# Altium project PCB_Project1.PrjPcb
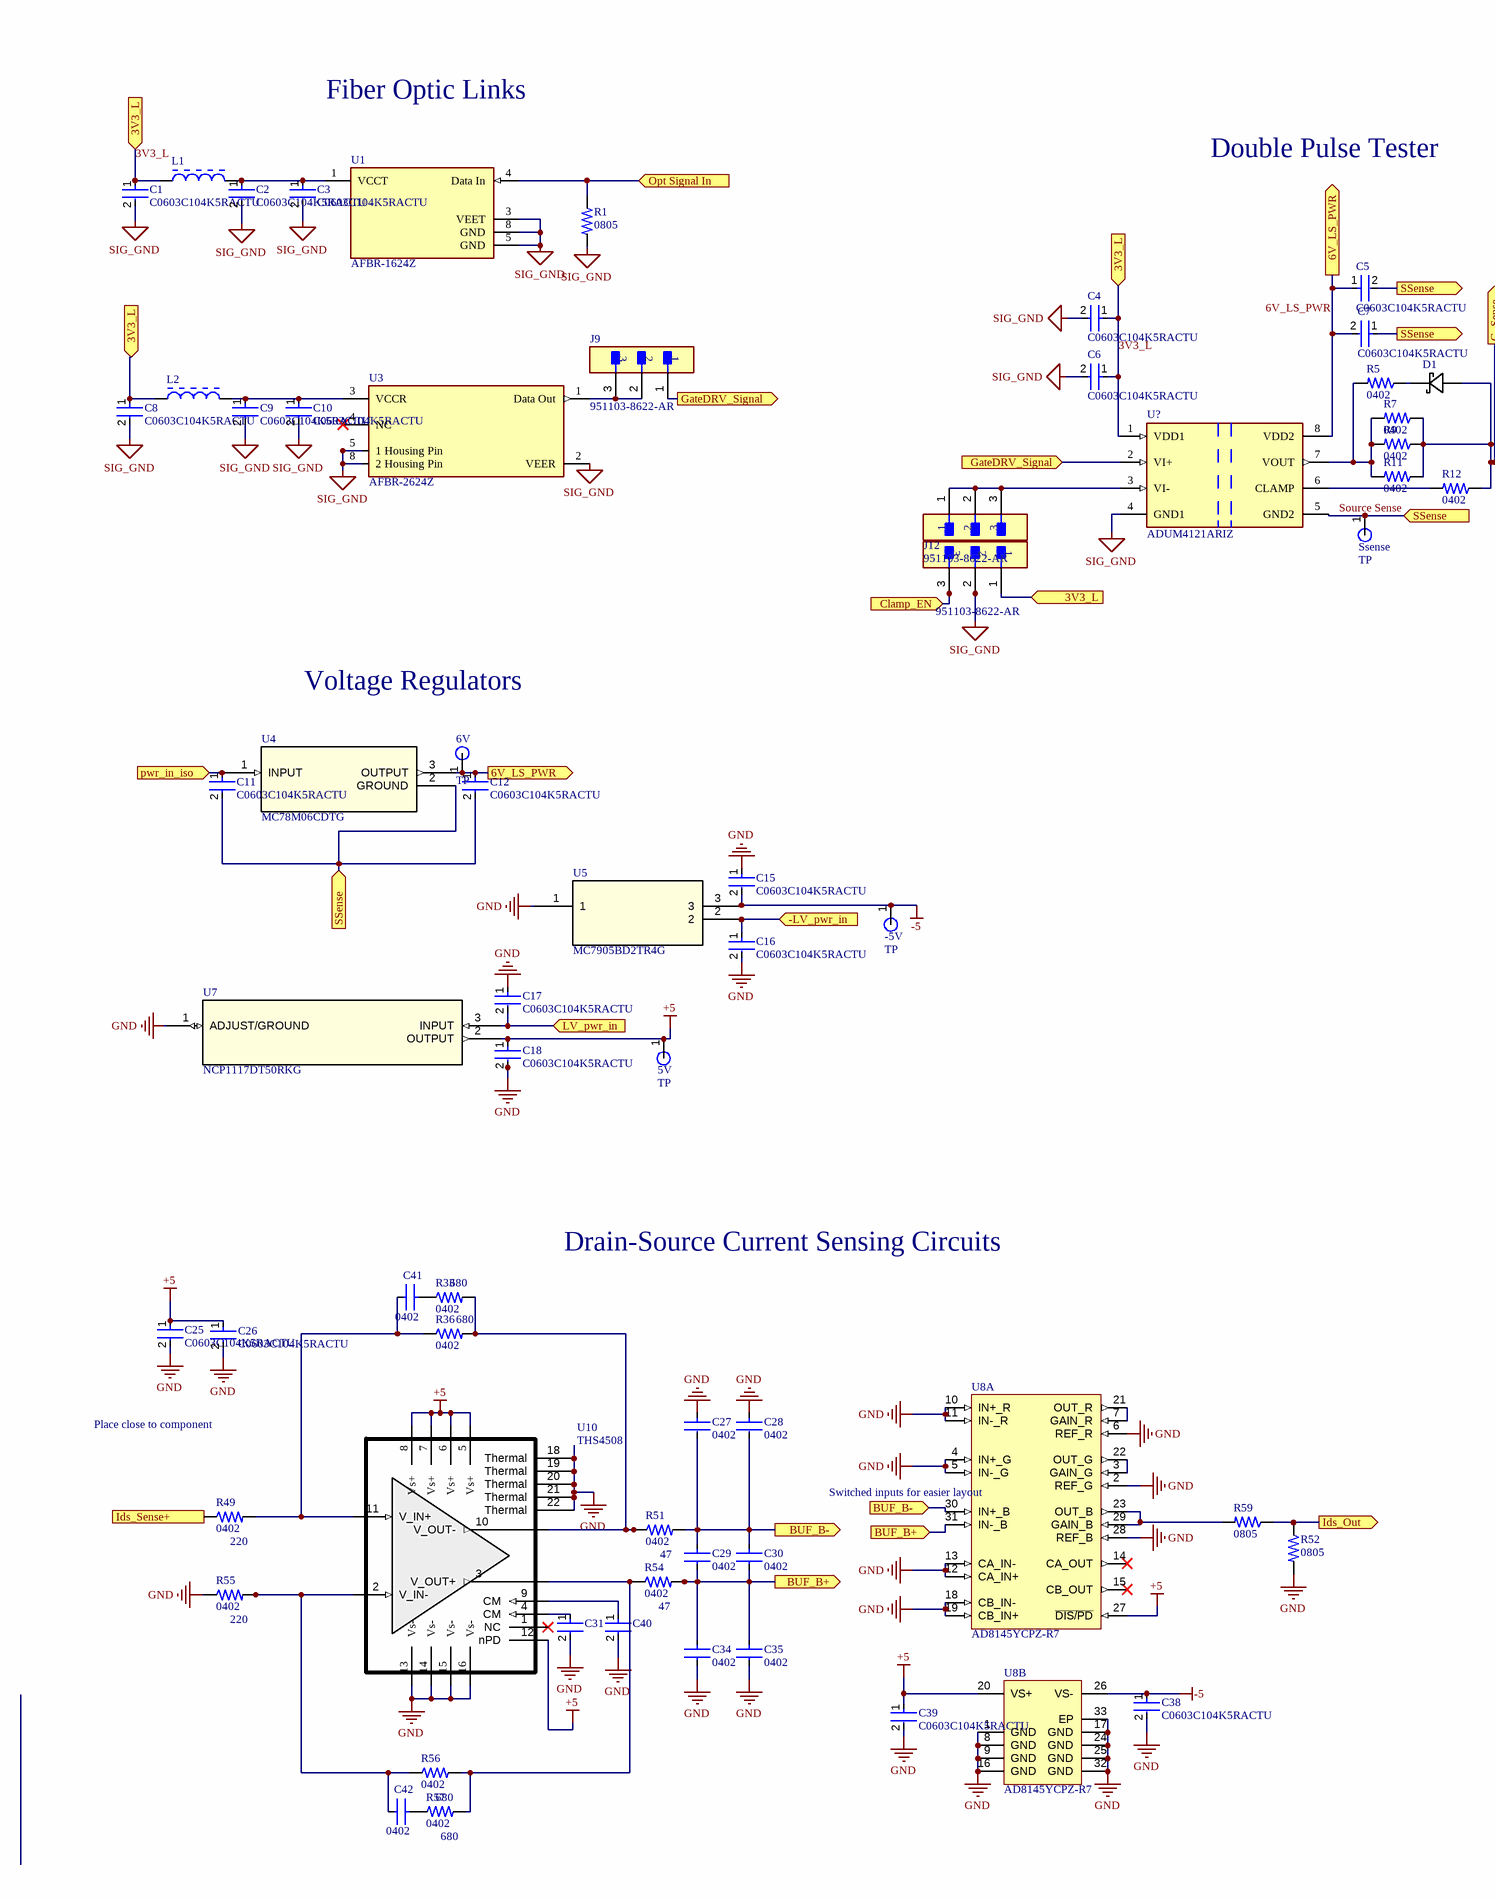
[diagram p0: DoublePulseTestCircuit.SchDoc, left]
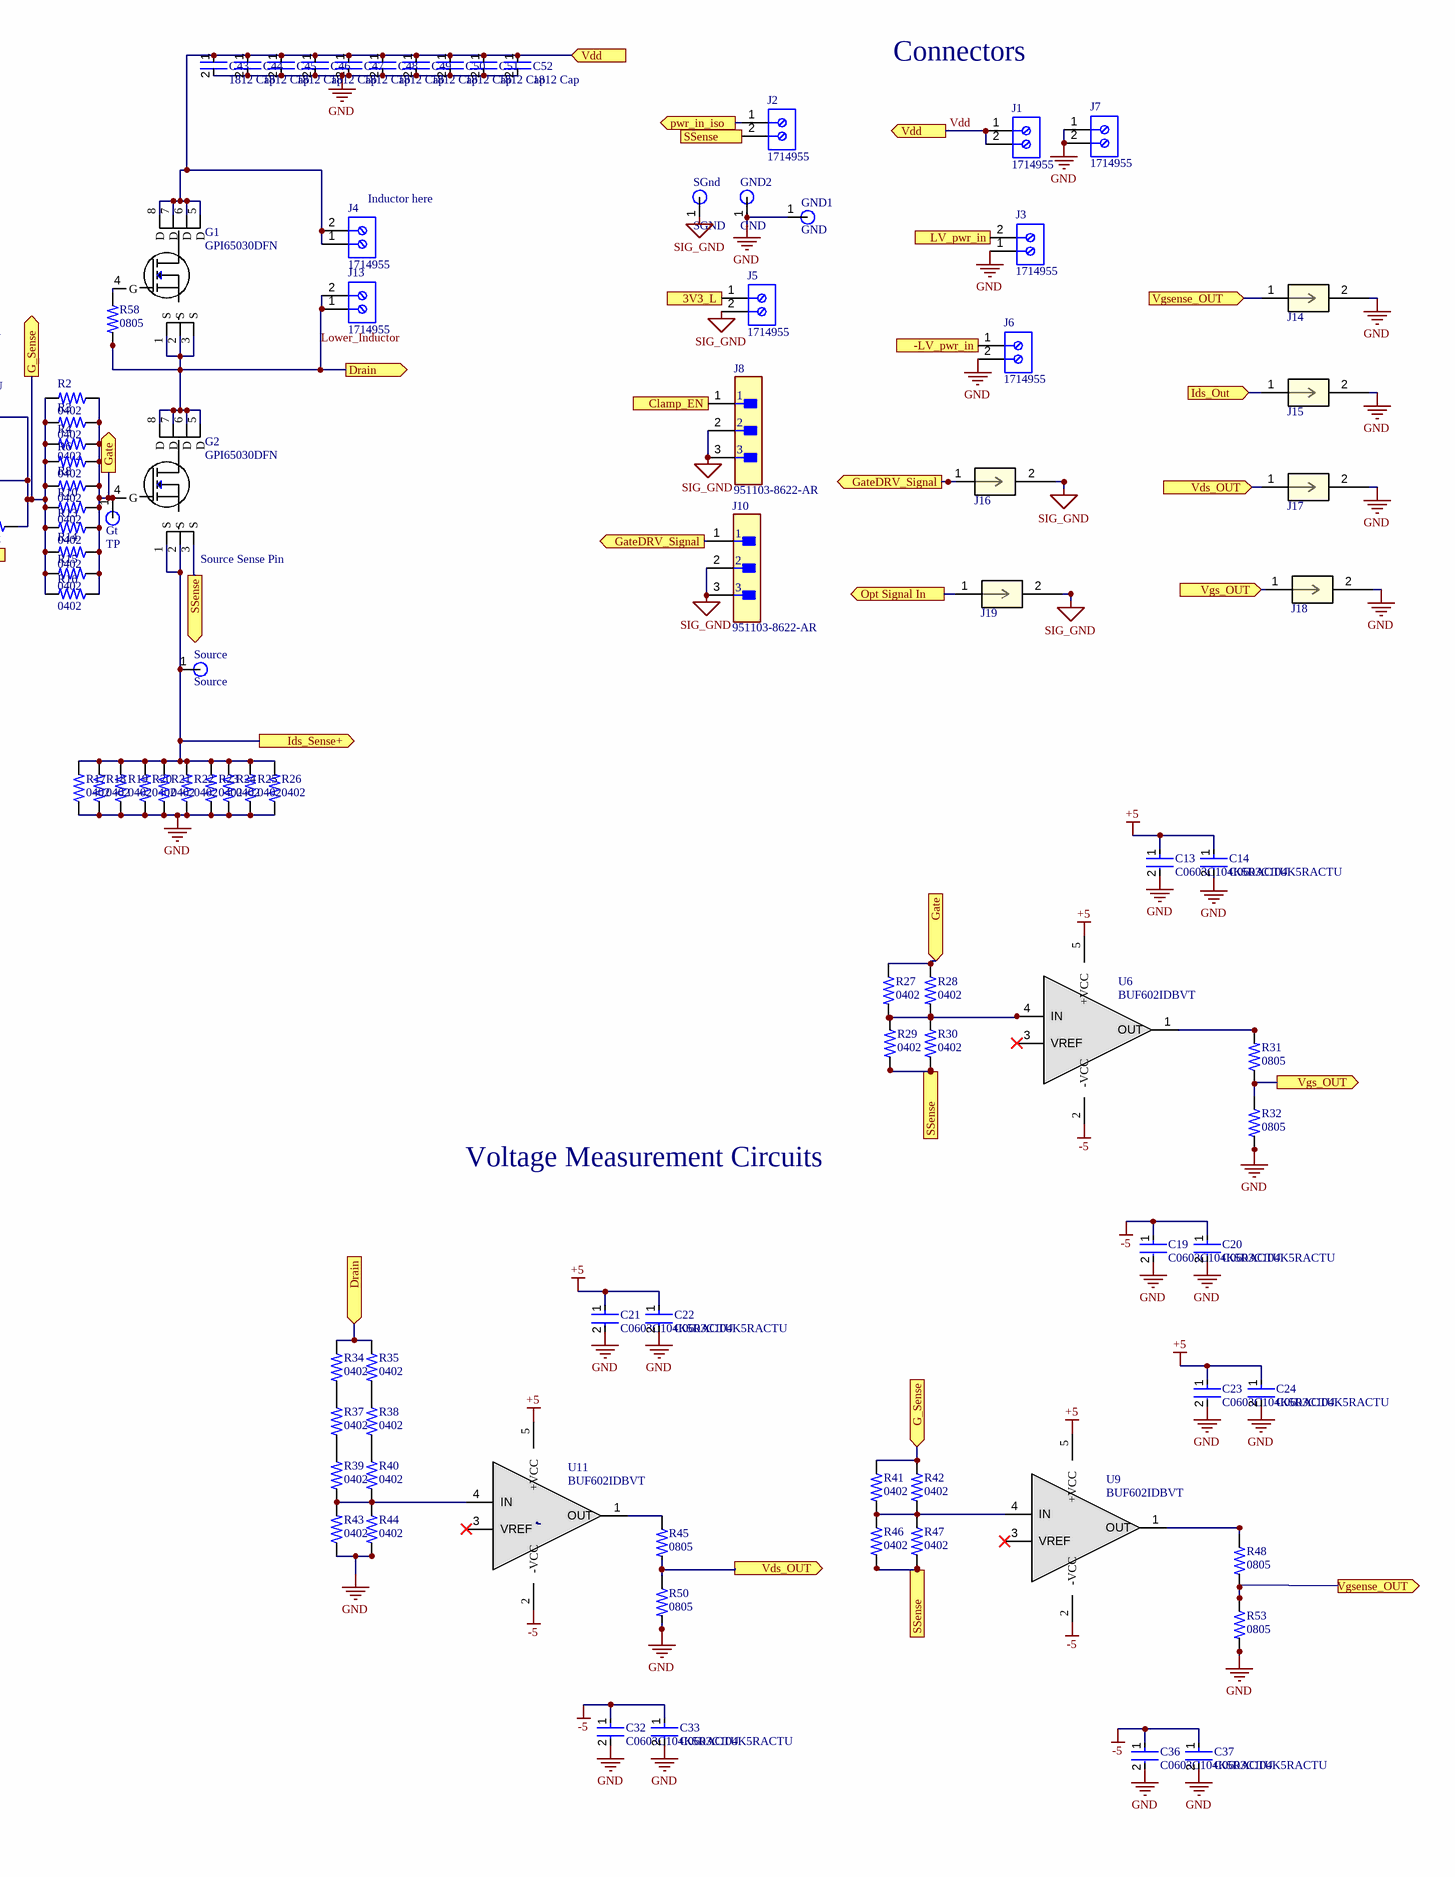
[diagram p1: DoublePulseTestCircuit.SchDoc, right]
1 sheet, 155 parts. Net scope: flat (ports and power ports of the same name join across sheets).
Board file: PCB1.PcbDoc

## Sheet DoublePulseTestCircuit.SchDoc
size 594 x 420 mm; SheetNumber: 1; SheetTotal: 1

### Parts
5V  TP  [Testpoint]
6V  TP  [Testpoint]
-5V  TP  [Testpoint]
C1  C0603C104K5RACTU  [FP-C0603C-CF-IPC_B]
C2  C0603C104K5RACTU  [FP-C0603C-CF-IPC_B]
C3  C0603C104K5RACTU  [FP-C0603C-CF-IPC_B]
C4  C0603C104K5RACTU  [FP-C0603C-CF-IPC_B]
C5  C0603C104K5RACTU  [FP-C0603C-CF-IPC_B]
C6  C0603C104K5RACTU  [FP-C0603C-CF-IPC_B]
C7  C0603C104K5RACTU  [FP-C0603C-CF-IPC_B]
C8  C0603C104K5RACTU  [FP-C0603C-CF-IPC_B]
C9  C0603C104K5RACTU  [FP-C0603C-CF-IPC_B]
C10  C0603C104K5RACTU  [FP-C0603C-CF-IPC_B]
C11  C0603C104K5RACTU  [FP-C0603C-CF-IPC_B]
C12  C0603C104K5RACTU  [FP-C0603C-CF-IPC_B]
C13  C0603C104K5RACTU  [FP-C0603C-CF-IPC_B]
C14  C0603C104K5RACTU  [FP-C0603C-CF-IPC_B]
C15  C0603C104K5RACTU  [FP-C0603C-CF-IPC_B]
C16  C0603C104K5RACTU  [FP-C0603C-CF-IPC_B]
C17  C0603C104K5RACTU  [FP-C0603C-CF-IPC_B]
C18  C0603C104K5RACTU  [FP-C0603C-CF-IPC_B]
C19  C0603C104K5RACTU  [FP-C0603C-CF-IPC_B]
C20  C0603C104K5RACTU  [FP-C0603C-CF-IPC_B]
C21  C0603C104K5RACTU  [FP-C0603C-CF-IPC_B]
C22  C0603C104K5RACTU  [FP-C0603C-CF-IPC_B]
C23  C0603C104K5RACTU  [FP-C0603C-CF-IPC_B]
C24  C0603C104K5RACTU  [FP-C0603C-CF-IPC_B]
C25  C0603C104K5RACTU  [FP-C0603C-CF-IPC_B]
C26  C0603C104K5RACTU  [FP-C0603C-CF-IPC_B]
C27  0402  [FP-C0402-BB-IPC_B]
C28  0402  [FP-C0402-BB-IPC_B]
C29  0402  [FP-C0402-BB-IPC_B]
C30  0402  [FP-C0402-BB-IPC_B]
C31  C0603C104K5RACTU  [FP-C0603C-CF-IPC_B]  (value not drawn)
C32  C0603C104K5RACTU  [FP-C0603C-CF-IPC_B]
C33  C0603C104K5RACTU  [FP-C0603C-CF-IPC_B]
C34  0402  [FP-C0402-BB-IPC_B]
C35  0402  [FP-C0402-BB-IPC_B]
C36  C0603C104K5RACTU  [FP-C0603C-CF-IPC_B]
C37  C0603C104K5RACTU  [FP-C0603C-CF-IPC_B]
C38  C0603C104K5RACTU  [FP-C0603C-CF-IPC_B]
C39  C0603C104K5RACTU  [FP-C0603C-CF-IPC_B]
C40  C0603C104K5RACTU  [FP-C0603C-CF-IPC_B]  (value not drawn)
C41  0402  [FP-C0402-BB-IPC_B]
C42  0402  [FP-C0402-BB-IPC_B]
C43  1812 Cap  [FP-C1812C104KDRACTU-IPC_A]
C44  1812 Cap  [FP-C1812C104KDRACTU-IPC_A]
C45  1812 Cap  [FP-C1812C104KDRACTU-IPC_A]
C46  1812 Cap  [FP-C1812C104KDRACTU-IPC_A]
C47  1812 Cap  [FP-C1812C104KDRACTU-IPC_A]
C48  1812 Cap  [FP-C1812C104KDRACTU-IPC_A]
C49  1812 Cap  [FP-C1812C104KDRACTU-IPC_A]
C50  1812 Cap  [FP-C1812C104KDRACTU-IPC_A]
C51  1812 Cap  [FP-C1812C104KDRACTU-IPC_A]
C52  1812 Cap  [FP-C1812C104KDRACTU-IPC_A]
D1  CDBQC0130L-HF  [SDO_0402C/SOD-923F_CIP]  (value not drawn)
G1  GPI65030DFN  [DFN795P800X45-4N]
G2  GPI65030DFN  [DFN795P800X45-4N]
GND1  GND  [Testpoint]
GND2  GND  [Testpoint]
Gt  TP  [Testpoint]
J1  1714955  [PHOE-1714955_V]
J2  1714955  [PHOE-1714955_V]
J3  1714955  [PHOE-1714955_V]
J4  1714955  [PHOE-1714955_V]
J5  1714955  [PHOE-1714955_V]
J6  1714955  [PHOE-1714955_V]
J7  1714955  [PHOE-1714955_V]
J8  951103-8622-AR  [FP-951103-8622-AR-MFG]
J9  951103-8622-AR  [FP-951103-8622-AR-MFG]
J10  951103-8622-AR  [FP-951103-8622-AR-MFG]
J11  951103-8622-AR  [FP-951103-8622-AR-MFG]
J12  951103-8622-AR  [FP-951103-8622-AR-MFG]
J13  1714955  [PHOE-1714955_V]
J14  RF2-04A-T-00-50-G  [CONN_RF2-04A-T-00-50-G_ADM]  (value not drawn)
J15  RF2-04A-T-00-50-G  [CONN_RF2-04A-T-00-50-G_ADM]  (value not drawn)
J16  RF2-04A-T-00-50-G  [CONN_RF2-04A-T-00-50-G_ADM]  (value not drawn)
J17  RF2-04A-T-00-50-G  [CONN_RF2-04A-T-00-50-G_ADM]  (value not drawn)
J18  RF2-04A-T-00-50-G  [CONN_RF2-04A-T-00-50-G_ADM]  (value not drawn)
J19  RF2-04A-T-00-50-G  [CONN_RF2-04A-T-00-50-G_ADM]  (value not drawn)
L1  SRN3015-1R0Y  [BOUR-SRN3015-2_V]  (value not drawn)
L2  SRN3015-1R0Y  [BOUR-SRN3015-2_V]  (value not drawn)
R1  0805  [RESC2012X65N]
R2  0402  [RESC1005X40X25ML05T05]
R3  0402  [RESC1005X40X25ML05T05]
R4  0402  [RESC1005X40X25ML05T05]
R5  0402  [RESC1005X40X25ML05T05]
R6  0402  [RESC1005X40X25ML05T05]
R7  0402  [RESC1005X40X25ML05T05]
R8  0402  [RESC1005X40X25ML05T05]
R9  0402  [RESC1005X40X25ML05T05]
R10  0402  [RESC1005X40X25ML05T05]
R11  0402  [RESC1005X40X25ML05T05]
R12  0402  [RESC1005X40X25ML05T05]
R13  0402  [RESC1005X40X25ML05T05]
R14  0402  [RESC1005X40X25ML05T05]
R15  0402  [RESC1005X40X25ML05T05]
R16  0402  [RESC1005X40X25ML05T05]
R17  0402  [RESC1005X40X25ML05T05]
R18  0402  [RESC1005X40X25ML05T05]
R19  0402  [RESC1005X40X25ML05T05]
R20  0402  [RESC1005X40X25ML05T05]
R21  0402  [RESC1005X40X25ML05T05]
R22  0402  [RESC1005X40X25ML05T05]
R23  0402  [RESC1005X40X25ML05T05]
R24  0402  [RESC1005X40X25ML05T05]
R25  0402  [RESC1005X40X25ML05T05]
R26  0402  [RESC1005X40X25ML05T05]
R27  0402  [RESC1005X40X25ML05T05]
R28  0402  [RESC1005X40X25ML05T05]
R29  0402  [RESC1005X40X25ML05T05]
R30  0402  [RESC1005X40X25ML05T05]
R31  0805  [RESC2012X65N]
R32  0805  [RESC2012X65N]
R33  0402  value 680  [RESC1005X40X25ML05T05]
R34  0402  [RESC1005X40X25ML05T05]
R35  0402  [RESC1005X40X25ML05T05]
R36  0402  value 680  [RESC1005X40X25ML05T05]
R37  0402  [RESC1005X40X25ML05T05]
R38  0402  [RESC1005X40X25ML05T05]
R39  0402  [RESC1005X40X25ML05T05]
R40  0402  [RESC1005X40X25ML05T05]
R41  0402  [RESC1005X40X25ML05T05]
R42  0402  [RESC1005X40X25ML05T05]
R43  0402  [RESC1005X40X25ML05T05]
R44  0402  [RESC1005X40X25ML05T05]
R45  0805  [RESC2012X65N]
R46  0402  [RESC1005X40X25ML05T05]
R47  0402  [RESC1005X40X25ML05T05]
R48  0805  [RESC2012X65N]
R49  0402  value 220  [RESC1005X40X25ML05T05]
R50  0805  [RESC2012X65N]
R51  0402  value 47  [RESC1005X40X25ML05T05]
R52  0805  [RESC2012X65N]
R53  0805  [RESC2012X65N]
R54  0402  value 47  [RESC1005X40X25ML05T05]
R55  0402  value 220  [RESC1005X40X25ML05T05]
R56  0402  value 680  [RESC1005X40X25ML05T05]
R57  0402  value 680  [RESC1005X40X25ML05T05]
R58  0805  [RESC2012X65N]
R59  0805  [RESC2012X65N]
SGnd  SGND  [Testpoint]
Source  Source  [Testpoint]
Ssense  TP  [Testpoint]
U1  AFBR-1624Z  [FP-AFBR-1624Z-MFG]
U3  AFBR-2624Z  [FP-AFBR-2624Z-MFG]
U4  MC78M06CDTG  [DPAK-3_ONS]
U5  MC7905BD2TR4G  [D2PAK3_ONS]
U6  BUF602IDBVT  [SOT95P280X145-5N]
U7  NCP1117DT50RKG  [DPAK-3_ONS]
U8  AD8145YCPZ-R7  [ADI-CP-32-3_M]  (parts A,B of 2)
U9  BUF602IDBVT  [SOT95P280X145-5N]
U10  THS4508  [QFN50P300X300X100-17N]
U11  BUF602IDBVT  [SOT95P280X145-5N]
U?  ADUM4121ARIZ  [FP-RI-8-1-IPC_A]

### Ports
3V3_L (in), 3V3_L (out), 6V_LS_PWR (out), -LV_pwr_in (in), -LV_pwr_in (out), BUF_B+ (in), BUF_B+ (out), BUF_B- (in), BUF_B- (out), Clamp_EN (in), Clamp_EN (out), Drain (in), Drain (out), G_Sense (in), G_Sense (out), Gate (in), Gate (out), GateDRV_Signal (in), GateDRV_Signal (out), Ids_Out (in), Ids_Out (out), Ids_Sense+ (in), Ids_Sense+ (out), LV_pwr_in (in), LV_pwr_in (out), Opt Signal In (in), Opt Signal In (out), pwr_in_iso (in), pwr_in_iso (out), SSense (in), SSense (out), Vdd (in), Vdd (out), Vds_OUT (in), Vds_OUT (out), Vgs_OUT (in), Vgs_OUT (out), Vgsense_OUT (in), Vgsense_OUT (out)

### Nets
+5: 5V.1(Input) C13.1 C14.1 C18.1 C21.1 C22.1 C23.1 C24.1 C25.1 C26.1 C39.1 U6.5(+VCC) U7.2(OUTPUT) U8.20(VS+) U8.27(~{DIS/PD}) U9.5(+VCC) U10.5(Vs+) U10.6(Vs+) U10.7(Vs+) U10.8(Vs+) U10.12(nPD) U11.5(+VCC)
-5: -5V.1(Input) C15.2 C19.1 C20.1 C32.1 C33.1 C36.1 C37.1 C38.1 U5.3 U6.2(-VCC) U8.26(VS-) U9.2(-VCC) U11.2(-VCC)
GND: C13.2 C14.2 C15.1 C16.2 C17.1 C18.2 C19.2 C20.2 C21.2 C22.2 C23.2 C24.2 C25.2 C26.2 C27.1 C28.1 C31.2 C32.2 C33.2 C34.2 C35.2 C36.2 C37.2 C38.2 C39.2 C40.2 C43.2 C44.2 C45.2 C46.2 C47.2 C48.2 C49.2 C50.2 C51.2 C52.2 GND1.1(Input) GND2.1(Input) J3.1 J6.2 J7.1 J7.2 J14.2 J15.2 J17.2 J18.2 R17.1 R18.1 R19.1 R20.1 R21.1 R22.1 R23.1 R24.1 R25.1 R26.1 R32.2 R43.1 R44.2 R50.2 R52.2 R53.2 R55.1 U5.1 U7.1(ADJUST/GROUND) U8.1(GND) U8.2(REF_G) U8.4(IN+_G) U8.5(IN-_G) U8.6(REF_R) U8.8(GND) U8.9(GND) U8.10(IN+_R) U8.11(IN-_R) U8.12(CA_IN+) U8.13(CA_IN-) U8.16(GND) U8.17(GND) U8.18(CB_IN-) U8.19(CB_IN+) U8.24(GND) U8.25(GND) U8.28(REF_B) U8.32(GND) U8.33(EP) U10.13(Vs-) U10.14(Vs-) U10.15(Vs-) U10.16(Vs-) U10.18(Thermal) U10.19(Thermal) U10.20(Thermal) U10.21(Thermal) U10.22(Thermal)
SIG_GND: C1.2 C2.2 C3.2 C4.2 C6.2 C8.2 C9.2 C10.2 J5.2 J8.2 J8.3 J10.2 J10.3 J11.2 J16.2 J19.2 R1.2 SGnd.1(Input) U1.3(VEET) U1.5(GND) U1.8(GND) U3.2(VEER) U3.5(1_Housing_Pin) U3.8(2_Housing_Pin) U?.4(GND1)
3V3_L: C1.1 C4.1 C6.1 C8.1 J5.1 J11.1 L1.1 L2.1 U?.1(VDD1) ; port 3V3_L
6V_LS_PWR: 6V.1(Input) C5.1 C7.2 C12.1 U4.3(OUTPUT) U?.8(VDD2) ; port 6V_LS_PWR
Lower_Inductor: G1.1(S) G1.2(S) G1.3(S) G2.5(D) G2.6(D) G2.7(D) G2.8(D) J13.1 J13.2 R34.1 R35.1 R58.2 ; port Drain
Source Sense: C5.2 C7.1 C11.2 C12.2 G2.3(S) J2.2 R29.2 R30.2 R46.2 R47.2 Ssense.1(Input) U4.2(GROUND) U?.5(GND2) ; port SSense
Vdd: C43.1 C44.1 C45.1 C46.1 C47.1 C48.1 C49.1 C50.1 C51.1 C52.1 G1.5(D) G1.6(D) G1.7(D) G1.8(D) J1.1 J1.2 J4.1 J4.2 ; port Vdd
NetC2_1: C2.1 C3.1 L1.2 U1.1(VCCT)
NetC9_1: C9.1 C10.1 L2.2 U3.3(VCCR)
NetC11_1: C11.1 J2.1 U4.1(INPUT) ; port pwr_in_iso
NetC16_1: C16.1 J6.1 U5.2 ; port -LV_pwr_in
NetC17_2: C17.2 J3.2 U7.3(INPUT) ; port LV_pwr_in
NetC27_2: C27.2 C28.2 C29.1 C30.1 R51.2 U8.30(IN+_B) ; port BUF_B-
NetC29_2: C29.2 C30.2 C34.1 C35.1 R54.2 U8.31(IN-_B) ; port BUF_B+
NetC31_1: C31.1 U10.4(CM)
NetC40_1: C40.1 U10.9(CM)
NetC41_1: C41.1 R33.1
NetC41_2: C41.2 R36.1 R49.2 U10.11(V_IN+)
NetC42_1: C42.1 R57.1
NetC42_2: C42.2 R55.2 R56.1 U10.2(V_IN-)
NetD1_1: D1.1 R5.1
NetD1_2: D1.2 R2.2 R3.2 R4.2 R6.2 R7.1 R8.2 R9.1 R10.2 R11.1 R12.1 R13.2 R14.2 R15.2 R16.2 R41.1 R42.1 ; port G_Sense
NetG1_4: G1.4(G) R58.1
NetG2_1: G2.1(S) G2.2(S) R17.2 R18.2 R19.2 R20.2 R21.2 R22.2 R23.2 R24.2 R25.2 R26.2 R49.1 Source.1(Input) ; port Ids_Sense+
NetG2_4: G2.4(G) Gt.1(Input) R2.1 R3.1 R4.1 R6.1 R8.1 R10.1 R13.1 R14.1 R15.1 R16.1 R27.1 R28.1 ; port Gate
NetJ8_1: J8.1 J11.3 ; port Clamp_EN
NetJ9_1: J9.1 J10.1 J16.1 U?.2(VI+) ; port GateDRV_Signal
NetJ9_2: J9.2 J9.3 U3.1(Data_Out)
NetJ12_1: J12.1 J12.2 J12.3 U?.3(VI-)
NetJ14_1: J14.1 R48.2 R53.1 ; port Vgsense_OUT
NetJ15_1: J15.1 R52.1 R59.1 ; port Ids_Out
NetJ17_1: J17.1 R45.2 R50.1 ; port Vds_OUT
NetJ18_1: J18.1 R31.1 R32.1 ; port Vgs_OUT
NetJ19_1: J19.1 R1.1 U1.4(Data_In) ; port Opt Signal In
NetR5_2: R5.2 R7.2 R9.2 R11.2 U?.7(VOUT)
NetR12_2: R12.2 U?.6(CLAMP)
NetR27_2: R27.2 R28.2 R29.1 R30.1 U6.4(IN)
NetR31_2: R31.2 U6.1(OUT)
NetR33_2: R33.2 R36.2 R51.1 U10.10(V_OUT-)
NetR34_2: R34.2 R37.1
NetR35_2: R35.2 R38.1
NetR37_2: R37.2 R39.1
NetR38_2: R38.2 R40.1
NetR39_2: R39.2 R40.2 R43.2 R44.1 U11.4(IN)
NetR41_2: R41.2 R42.2 R46.1 R47.1 U9.4(IN)
NetR45_1: R45.1 U11.1(OUT)
NetR48_1: R48.1 U9.1(OUT)
NetR54_1: R54.1 R56.2 R57.2 U10.3(V_OUT+)
NetR59_2: R59.2 U8.23(OUT_B) U8.29(GAIN_B)
NetU8_3: U8.3(GAIN_G) U8.22(OUT_G)
NetU8_7: U8.7(GAIN_R) U8.21(OUT_R)

Not connected (* = marked no-connect by the designer): U3 4(NC)*; U6 3(VREF)*; U8 14(CA_OUT)* 15(CB_OUT)*; U9 3(VREF)*; U10 1(NC)*; U11 3(VREF)*

### Notes on the sheet
- Connectors
- Fiber Optic Links
- Double Pulse Tester
- (near J4) Inductor here
- (near G2) Source Sense Pin
- Voltage Regulators
- Voltage Measurement Circuits
- Drain-Source Current Sensing Circuits
- Place close to component
- (near U8) Switched inputs for easier layout
- DWG NO:
- REV:
- THIS DOCUMENT AND THE DATA DISCLOSED HEREIN OR
- HEREWITH IS THE PROPERTY OF ALTIUM LIMITED AND MAY
- BE FREELY DISTRIBUTED IN WHOLE. NO RIGHTS ARE
- RESERVED OR EXPRESS OR IMPLIED WARANTEE GIVEN.
- REVISION
- DESCRIPTION
- DATE
- APPROVED
- ENG:
- APPROVALS
- PROJECT
- DSN:
- CHK:
- REFERENCE DOCUMENTS
- PROJECT REVISION:
- TITLE
- DOCUMENT REVISION:
- DESIGN ITEM:
- BOM:
- FAB DWG:
- PCB DWG:
- ASSY DWG:
- SCALE:
- A2
- SIZE
- CAGE CODE
- FILE NAME
- DWG NO.
- SHEET
- OF
- REV

### Library data of the parts
C1-C26 C31-C33 C36-C40 = CMP-2006-03061-2: CAP CER 0.1UF 50V X7R 0603; Manufacturer: KEMET; Tolerance: 0.1; Temperature Coefficient: 30ppm/°C; Material: Ceramic; Automotive Grade: Grade 1; Value: 0.10 μF; Temperature: -55°C to +125°C; RoHS: TRUE; Temperature Range High: +125°C; Lead Free: Yes; Octopart: https://octopart.com/c0603c104k5ractu-kemet-139244; Digikey Description: CAP CER 0.1UF 50V X7R 0603; Category: Cap; Package: C0603C-CF; ComponentLink2Description: Datasheet; Temperature Range Low: -55°C; Device Class L1: Passive Components; Voltage Rating: 50 V; Automotive: Yes; Device Class L3: Ceramic Capacitors; ComponentLink2URL: https://api.kemet.com/component-edge/download/datasheet/C0603C100J5GACAUTO.pdf; Capacitance: 0.10 μF; Device Class L2: Capacitors; Manufacturer Part Number: C0603C104K5RACTU; Temperature Characteristic: X7R; Height: 0.87mm
C27-C30 C34 C35 C41 C42 = 1: CAP CER 0.1UF 10V X5R 0402; Manufacturer: Kemet; Manufacturer Part Number: C0402C104K8PACTU; Material: Ceramic; Capacitance: 0.10 μF; Temperature Coefficient: 15%; Tolerance: 0.1; Value: 0.10 μF; Package: C0402-BB; Temperature: -55°C to +125°C; ComponentLink2Description: Datasheet; Temperature Characteristic: X5R; Device Class L1: Passive Components; Height: 0.55mm; Lead Free: Yes; ComponentLink2URL: https://content.kemet.com/datasheets/KEM_C1002_X7R_SMD.pdf; Device Class L2: Capacitors; Temperature Range Low: -55°C; Temperature Range High: +125°C; RoHS: TRUE; Octopart: https://octopart.com/c0402c104k8pactu-kemet-140039; Automotive: No; Mouser Description: Capacitor 100 nF 10 VDC 0402 | KEMET C0402C104K8PACTU (Capacitor 100 nF 10 VDC 0402 Ceramic Capacitors).; Category: Cap; Voltage Rating: 10 V; Digikey Description: CAP CER 0.1UF 10V X5R 0402; Ipc Land Pattern Name: CAPC10050X50; Device Class L3: Ceramic Capacitors
D1 = CDBQC0130L-HF: No Description Available; Mfr_Name: Comchip; Type: DEV; Copyright: Copyright (C) 2022 Ultra Librarian. All rights reserved.; Manufacturer_Part_Number: CDBQC0130L-HF; Digi-Key_Part_Number_1: 641-1519-2-ND; Digi-Key_Part_Number_2: 641-1519-1-ND; Digi-Key_Part_Number_3: 641-1519-6-ND; RefDes: RefDes
GND1 GND2 SGnd Source = TP
J1-J7 J13 = CMP-2000-05797-1: PC Terminal Block, Pitch 6.35 mm, 1 x 2 Position, Height 21.5 mm, Tail Lenght 5.1 mm, RoHS, Bulk; Manufacturer: Phoenix Contact; Package Description: PC Terminal Block, Pitch 6.35 mm, 1 x 2 Position, Height 21.5 mm, Tail Lenght 5.1 mm; Datasheet URL: http://media.digikey.com/pdf/Data%20Sheets/Phoenix%20Contact%20PDFs/1714955.pdf; Package Reference: 1714955; Manufacturer URL: http://www.phoenixcontact.com/; Datasheet Version: 02/2010; Mounting Technology: ThroughHole
J8-J12 = CMP-05379-000003-1: CONN HEADER VERT 3POS 2MM; Manufacturer: 3M; Conn Gender: Male; Current Rating: 2A; Number Of Contacts: 3; Conn Orientation: Straight; Digikey Description: CONN HEADER VERT 3POS 2MM; Device Class L3: unset; Category: Conn; Height: 6.3mm; Manufacturer Part Number: 951103-8622-AR; RoHS: TRUE; Contact Material: Gold,Nickel; ComponentLink2Description: Datasheet; Temperature Range Low: -55°C; Device Class L1: Connectors; Pitch: 2mm; Mouser Description: Header; PinStrip; CopperAlloy; HighTempThermoplastic; 3Cnts; 1A; RtAngle; 951Series; Octopart: https://octopart.com/951103-8622-ar-3m-14400669; Package: 951103-8622-AR; Lead Free: Yes; Device Class L2: Headers and Wire Housings; Temperature Range High: +125°C; ComponentLink2URL: http://multimedia.3m.com/mws/media/1400506O/3m-pin-strip-header-951-series-78-5100-2653-3.pdf; Automotive: No; Temperature: -55°C to +125°C; Number Of Rows: 1
J14-J19 = RF2-04A-T-00-50-G: No Description Available; Mfr_Name: ADAM TECHNOLOGIES INC; Copyright: Copyright (C) 2022 Ultra Librarian. All rights reserved.; Manufacturer_Part_Number: RF2-04A-T-00-50-G; Digi-Key_Part_Number_1: 2057-RF2-04A-T-00-50-G-ND; RefDes: RefDes; Type: DEV
L1 L2 = CMP-0007-00007-1: Semi-shielded Power Inductor, 1 uH, +/- 30%, 2.35 A, -40 to 125 degC, 3 x 3 x 1.5 mm SMD, RoHS and Halogen Free, Tape and Reel; Manufacturer: Bourns; Inductance tolerance: +/- 30%; DCR Max: 0.048 Ohm; Resistance to Solder Heat: +260 degC for 10 sec.; SRF Min: 145 MHz; Inductance: 1 uH; Isat: 2.35 A; ComponentLink3URL: http://www.bourns.com/data/global/pdfs/SRN3015.pdf; Packing: Tape and Reel; ComponentLink1Description: Manufacturer URL; DatasheetVersion: Aug-11; ComponentLink2URL: http://www.bourns.com/data/global/pdfs/SRN3015.pdf; PartNumber: SRN3015-1R0Y; ComponentLink3Description: Package Specification; RoHS: TRUE; Mounting Technology: Surface Mount; ComponentLink1URL: http://www.bourns.com/; Operating Temperature: -40 to 125 degC; Rated current: 2.35 A; PackageDescription: 2-Pin SMD, Body 3 x 3 mm, Height 1.5 mm; ComponentLink2Description: Datasheet; PackageReference: SRN3015
R1 R31 R32 R45 R48 R50 R52 R53 R58 R59 = R0805: MP: 2-2176053-2; Resistance: .39; Power_Rating: .25 W; MF: TE Connectivity; Tolerance: 1%; Package: 0805; Value: *; SnapEDA_Link: https://www.snapeda.com/parts/2-2176053-2/TE%20Connectivity/view-part/2214511/?ref=snap; Availability: Unavailable; Price: None; EU_RoHS_Compliance: Compliant with Exemptions
R2-R30 R33-R44 R46 R47 R49 R51 R54-R57 = R0402: MP: 6-1676480-4; Package: None; Price: None; Availability: Unavailable
  R2-R30 R34 R35 R37-R44 R46 R47: Value: *
U1 = CMP-18396-000003-1: TXRX OPT 650NM 1MM POF; Operating Supply Voltage: 3.3V; Operating Supply Current: 21mA; Rise Time: 5ns; Number of Pins: 6; Series: Versatile Link; Max Operating Temperature: 85°C; Mount: Through Hole; Min Operating Temperature: -40°C; REACH SVHC: No SVHC; Length: 18.8mm; Height: 7.62mm; Width: 12.19mm; Wavelength: 650nm; Forward Current: 21mA; Fall Time: 5ns; Package Quantity: 200; Forward Voltage: 3.3V
U3 = CMP-18396-000004-1: RCVR OPT DC-50MBD 1MM POF; Operating Supply Current: 20mA; Fall Time: 5ns; Operating Supply Voltage: 5V; Wavelength: 650nm; Max Operating Temperature: 85°C; Number of Pins: 4; Length: 18.8mm; Series: -; Package Quantity: 200; Rise Time: 5ns; Min Operating Temperature: -40°C; REACH SVHC: No SVHC; Mount: Snap in; Width: 12.19mm; Height: 7.62mm
U4 = MC78M06CDTG: No Description Available; Mfr_Name: onsemi; Copyright: Copyright (C) 2022 Ultra Librarian. All rights reserved.; Manufacturer_Part_Number: MC78M06CDTG; Digi-Key_Part_Number_1: MC78M06CDTGOS-ND; Digi-Key_Part_Number_2: 2156-MC78M06CDTG-OS-ND; RefDes: RefDes; Type: DEV
U5 = MC7905BD2TR4G: No Description Available; Mfr_Name: onsemi; Copyright: Copyright (C) 2022 Ultra Librarian. All rights reserved.; Manufacturer_Part_Number: MC7905BD2TR4G; Digi-Key_Part_Number_1: 2156-MC7905BD2TR4G-OS-ND; Digi-Key_Part_Number_2: MC7905BD2TR4G-ND; Digi-Key_Part_Number_3: MC7905BD2TR4GOSCT-ND; Digi-Key_Part_Number_4: MC7905BD2TR4GOSDKR-ND; Digi-Key_Part_Number_5: MC7905BD2TR4GOSTR-ND; RefDes: RefDes; Type: DEV
U6 U9 U11 = BUF602IDBVT: 1000MHz,Wide Bandwidth, High-Speed, Closed Loop Buffer 5-SOT-23 -45 to 85; MF: Texas Instruments; Purchase-URL: https://pricing.snapeda.com/search/part/BUF602IDBVT/?ref=eda; Package: SOT-23-5 Texas Instruments; Check_prices: https://www.snapeda.com/parts/BUF602IDBVT/Texas%20Instruments/view-part/11391/?ref=eda; Value: *; MP: BUF602IDBVT; Price: None; Availability: Good; SnapEDA_Link: https://www.snapeda.com/parts/BUF602IDBVT/Texas%20Instruments/view-part/11391/?ref=snap
U7 = NCP1117DT50RKG: No Description Available; Mfr_Name: onsemi; Copyright: Copyright (C) 2022 Ultra Librarian. All rights reserved.; Manufacturer_Part_Number: NCP1117DT50RKG; Digi-Key_Part_Number_1: 2156-NCP1117DT50RKG-OS-ND; Digi-Key_Part_Number_2: =NCP1117DT50RKG; Digi-Key_Part_Number_3: NCP1117DT50RKGOSCT-ND; Digi-Key_Part_Number_4: NCP1117DT50RKGOSDKR-ND; Digi-Key_Part_Number_5: NCP1117DT50RKGOSTR-ND; RefDes: RefDes; Type: DEV
U8 = CMP-0787-00033-1: High Speed, Triple Differential Receiver with Comparator, 4.5 to 11 V Supply, 500 MHz Bandwidth, Industrial, 32-pin QFN (CP-32-3), Reel; Manufacturer: Analog Devices; -3dB Bandwidth: 500MHz, 425MHz; Max Pos Supply: 11V, 11V; Minimum Gain (Acl): 1; Slew Rate (V/us): 2100, 2000; 0.1 dB Flatness (MHz): 75, 53; Min Pos Supply: 4.5V, 4.5V; Packing: Reel; PartNumber: AD8145YCPZ-R7; ComponentLink1Description: Manufacturer URL; ComponentLink2Description: Datasheet; PackageReference: CP-32-3; ComponentLink3Description: Package Specification; PackageDescription: 32-Pin Lead Frame Chip Scale Package, Body 5 x 5 mm, Pitch 0.5 mm; ComponentLink4Description: URL Link1; ComponentLink1URL: http://www.analog.com/en/index.html; ComponentLink3URL: http://www.analog.com/static/imported-files/packages/32877413525511988CP_32_3.pdf; DatasheetVersion: Rev. A; Code_JEDEC: MO-220-VHHD-2; Mounting Technology: Surface Mount; ComponentLink2URL: http://www.analog.com/static/imported-files/data_sheets/AD8145.pdf; ComponentLink4URL: Product URL:http://www.analog.com/en/specialty-amplifiers/video-ampsbuffersfilters/ad8145/products/product.html; PackageVersion: Jan-05
U? = CMP-09133-000031-1: DGTL ISO 5KV 1CH GATE DRVR 8SOIC; RoHS Compliant: Yes; Number of Pins: 8